# EAGLE design Blinky (EAGLE 7.7.0)
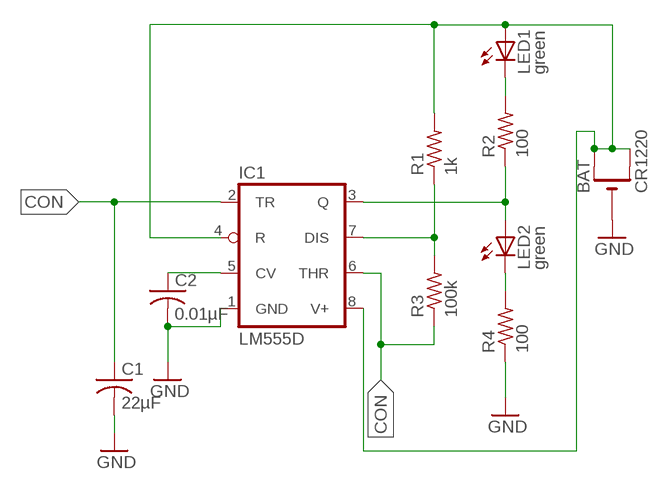
[diagram p0: schematic, sheet 1]

## Parts
BAT  CR1220  CR1220SMT  [CR1220-SMD]
C1  22µF  C-USC0805  [C0805]
C2  0.01µF  C-USC0805  [C0805]
IC1  LM555D  [SO08]
LED1  green  LEDCHIPLED_0805  [CHIPLED_0805]
LED2  green  LEDCHIPLED_0805  [CHIPLED_0805]
R1  1k  R-US_R0805  [R0805]
R2  100  R-US_R0805  [R0805]
R3  100k  R-US_R0805  [R0805]
R4  100  R-US_R0805  [R0805]

## Nets
BAT: IC1.8(V+)
CON: C1.1 IC1.2(TR) IC1.6(THR) R3.1
GND: BAT.- C1.2 C2.2 IC1.1(GND)
N$1: LED1.C R2.2
N$2: IC1.3(Q) LED2.A R2.1
N$3: LED2.C R4.2
N$4: R4.1 ; supply symbol labelled GND
N$5: IC1.7(DIS) R1.1 R3.2
N$6: BAT.+$1(+) BAT.+$2(+1) IC1.4(R) LED1.A R1.2
N$10: C2.1 IC1.5(CV)

## Library data of the parts
BAT = adafruit:CR1220: CR1216/CR1220/CR1225 12mm 3V lithium coin cell Great for battery packup. Both SMT and THM holders. Note the THM package has the ground pads on both sides of the PCB so that the masks are the same - this reduces the cost
C1 C2 = adafruit:C-US: CAPACITOR, American symbol
IC1 = adafruit:*555: TIMER Changed DIP package to have round (not oval) pin pads http://www.ladyada.net/library/pcb/eaglelibrary.html
LED1 LED2 = adafruit:LED: LED OSRAM: - CHIPLED LG R971, LG N971, LY N971, LG Q971, LY Q971, LO R971, LY R971 LH N974, LH R974 LS Q976, LO Q976, LY Q976 LO Q996 - Hyper CHIPLED LW Q18S LB Q993, LB Q99A, LB R99A - SideLED LS A670, LO A670, LY A670, LG A670, LP A670 LB A673, LV A673, LT A673, LW A673 LH A674 LY A675 LS A676, LA A676, LO A676, LY A676, LW A676 LS A679, LY A679, LG A679 - Hyper Micro SIDELED® LS Y876, LA Y876, LO Y876, LY Y876 LT Y87S - SmartLED LW L88C, LW L88S LB L89C, LB L89S, LG L890 LS L89K, LO L89K, LY L89K LS L896, LA L896, LO L896, LY L896 - TOPLED LS T670, LO T670, LY T670, LG T670, LP T670 LSG T670, LSP T670, LSY T670, LOP T670, LYG T670 LG T671, LOG T671, LSG T671 LB T673, LV T673, LT T673, LW T673 LH T674 LS T676, LA T676, LO T676, LY T676, LB T676, LH T676, LSB T676, LW T676 LB T67C, LV T67C, LT T67C, LS T67K, LO T67K, LY T67K, LW E67C LS E67B, LA E67B, LO E67B, LY E67B, LB E67C, LV E67C, LT E67C LW T67C LS T679, LY T679, LG T679 LS T770, LO T770, LY T770, LG T770, LP T770 LB T773, LV T773, LT T773, LW T773 LH T774 LS E675, LA E675, LY E675, LS T675 LS T776, LA T776, LO T776, LY T776, LB T776 LHGB T686 LT T68C, LB T68C - Hyper Mini TOPLED® LB M676 - Mini TOPLED Santana® LG M470 LS M47K, LO M47K, LY M47K Source: http://www.osram.convergy.de/
R1-R4 = adafruit:R-US_: RESISTOR, American symbol

## Net classes
0 default: width 0.305 mm, drill 0.381 mm, clearance 0.254 mm

## Board
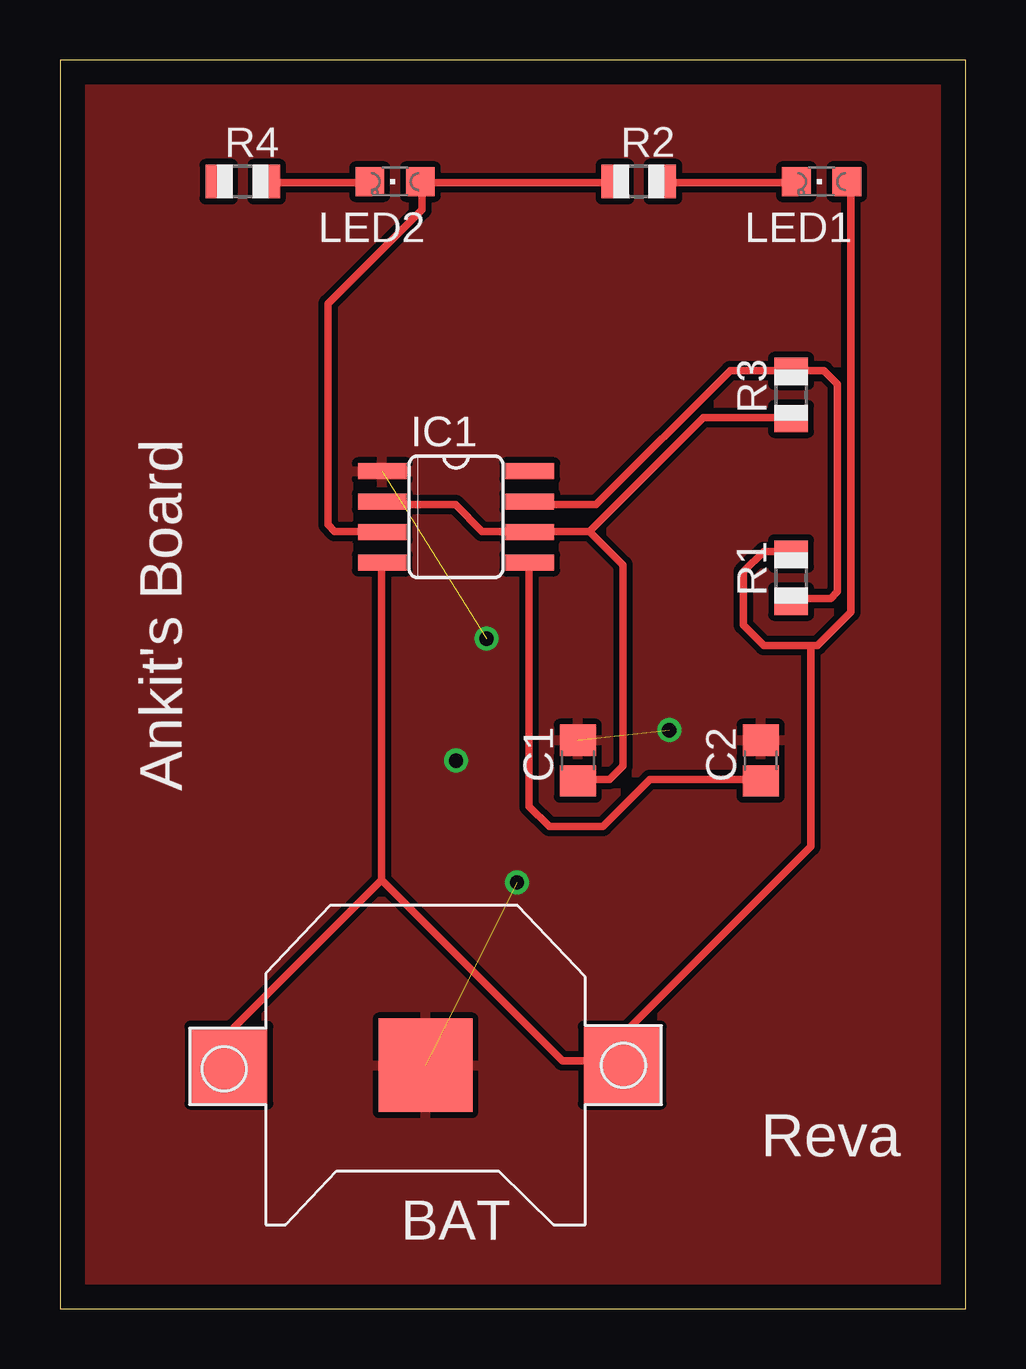
[diagram p1: board, top side]
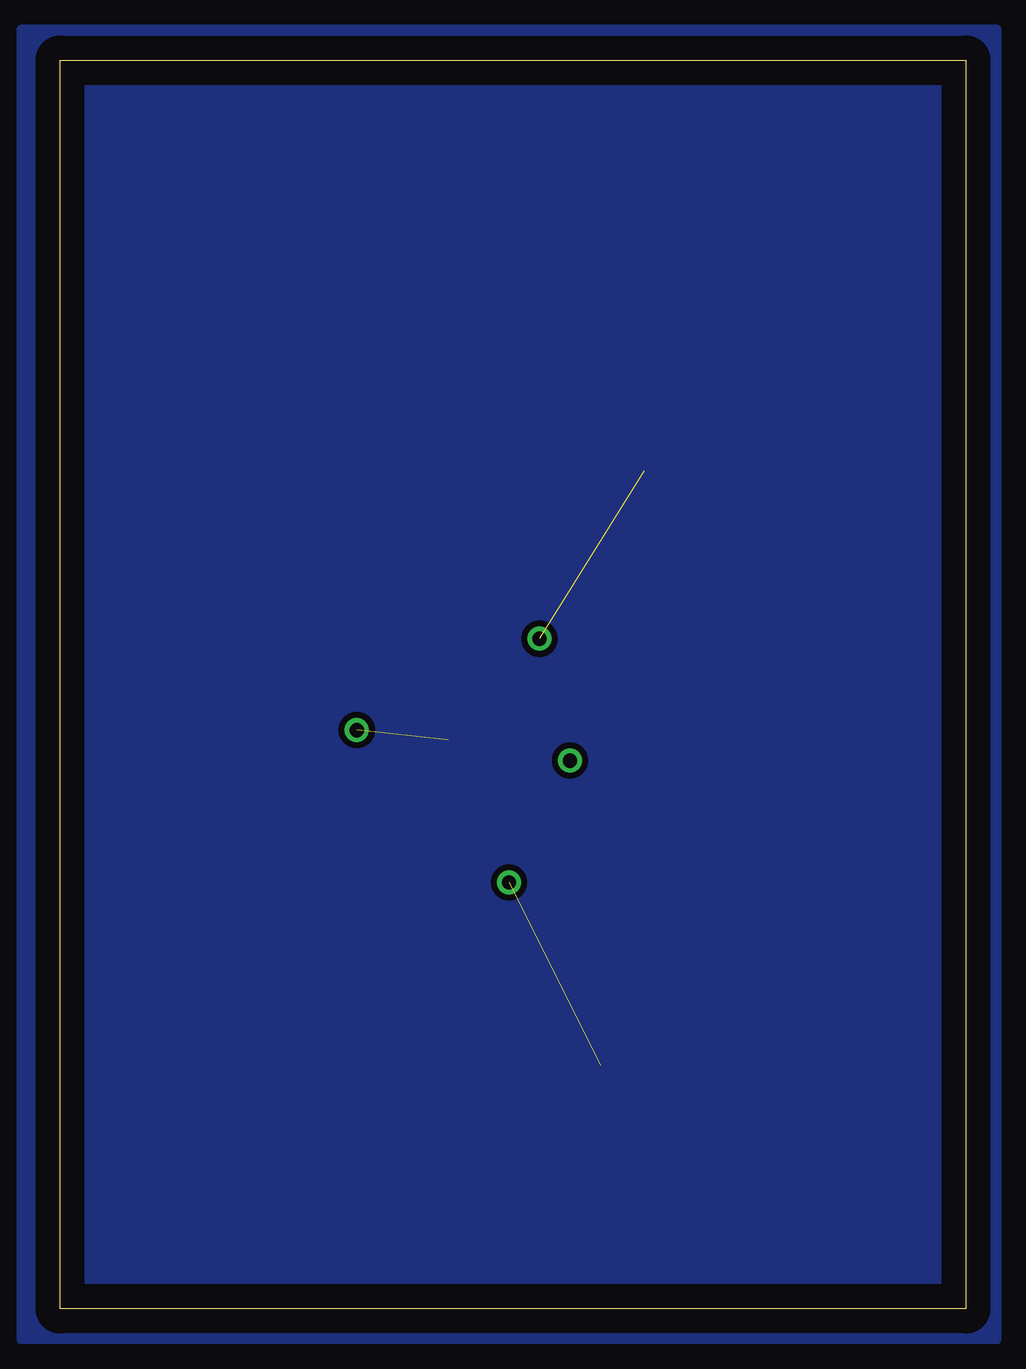
[diagram p2: board, bottom side, seen from below]

Size 37.77 x 52.06 mm. Coordinates in mm from the lower left corner, seen from the top.
Outline: 0,0 37.77,0 37.77,52.06 0,52.06 0,0
Copper layers (1*16): Top 0.035mm / dielectric 1.5mm / Bottom 0.035mm
Design rules "default *": minimum track width 10mil, minimum drill 20mil, track to track 8mil, track to pad 8mil, pad to pad 8mil, via to via 8mil, smd to smd 8mil, copper to edge 40mil, drill to drill 8mil, minimum pad ring 10mil, minimum via ring 8mil, stop-mask expansion 4mil, vias tented up to drill 0mil, thermal gap 10mil

### Footprints (pad centres in the part's own frame; a part is rotated, then mirrored left to right if it is on the bottom)
CR1220-SMD = smd 3.2 x 3.2: +$1 -8.2,0; +$2 8.2,0 | smd 3.9 x 3.9: - 0,0
C0805 = smd 1.3 x 1.5: 1 -0.85,0; 2 0.85,0
SO08 = smd 0.66 x 2.032: 1 -1.905,-3.073; 2 -0.635,-3.073; 3 0.635,-3.073; 4 1.905,-3.073; 5 1.905,3.073; 6 0.635,3.073; 7 -0.635,3.073; 8 -1.905,3.073
CHIPLED_0805 = smd 1.2 x 1.2: A 0,-1.05; C 0,1.05
R0805 = smd 1.1 x 1.4: 1 -1,0; 2 1,0

### Placement (x,y rotation side)
BAT  15.24,10.16 180 top
C1  21.59,22.86 90 top
C2  29.21,22.86 90 top
IC1  16.51,33.02 270 top
LED1  31.75,46.99 90 top
LED2  13.97,46.99 90 top
R1  30.48,30.48 90 top
R2  24.13,46.99 0 top
R3  30.48,38.1 90 top
R4  7.62,46.99 0 top

### Tracks (layer width: path | path; a pad name or v marks a point on that pad's centre or on a via)
CON
  Top 0.305: 22.07,32.41 26.82,37.16 30.45,37.16 R3.1 | 22.07,32.41 19.84,32.41 IC1.6 19.56,32.41 17.6,32.41 16.48,33.53 13.69,33.53 IC1.2 | 22.07,32.41 23.47,31.01 23.47,22.63 22.91,22.07 21.79,22.07 C1.1
GND  (via drill 0.6)  (3 unrouted)
  other vias: 25.4,24.13 19.05,17.78 17.78,27.94 16.51,22.86
  pour Top: -1.27,53.34 -1.27,-1.27 39.37,-1.27 39.37,53.34
N$1
  Top 0.305: LED1.C 30.45,46.94 25.15,46.94 R2.2
N$2
  Top 0.305: 15.09,46.94 22.91,46.94 R2.1 | 15.09,46.94 15.09,45.82 11.18,41.91 11.18,32.69 11.46,32.41 13.41,32.41 IC1.3 | 15.09,46.94 LED2.A
N$3
  Top 0.305: LED2.C 12.85,46.94 8.66,46.94 R4.2
N$5
  Top 0.305: R1.1 30.73,29.62 32.13,29.62 32.41,29.9 32.41,38.56 31.85,39.12 30.73,39.12 R3.2 30.45,39.12 27.94,39.12 22.35,33.53 19.84,33.53 IC1.7
N$6
  Top 0.305: 31.29,27.66 29.34,27.66 28.5,28.5 28.5,30.73 29.34,31.57 30.45,31.57 R1.2 | 31.29,27.66 31.57,27.66 32.97,29.06 32.97,46.94 LED1.A | 13.41,17.88 13.41,31.01 IC1.4 | 13.41,17.88 7.26,11.73 7.26,10.34 BAT.+$2 | 13.41,17.88 20.95,10.34 23.19,10.34 BAT.+$1 23.47,10.34 23.47,11.46 31.29,19.28 31.29,27.66
N$7
  pour Bottom: -1.27,53.34 -1.27,-1.27 39.37,-1.27 39.37,0 39.37,53.34
N$10
  Top 0.305: C2.1 29.06,22.07 24.59,22.07 22.63,20.12 20.4,20.12 19.56,20.95 19.56,31.01 IC1.5

### Text on the board
tPlace: Ankit's Board | Reva